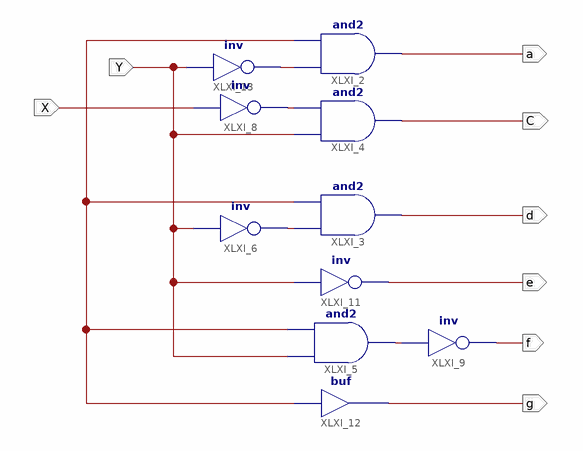
[diagram p0: schematic sheet 1]
// Xilinx ISE schematic SW.sch (spartan6) as structural Verilog: 10 symbols, 8 ports
module SW (
  input  X,
  input  Y,
  output C,
  output d,
  output e,
  output f,
  output a,
  output g
);

  wire XLXN_2, XLXN_16, XLXN_17, XLXN_18, XLXN_44;

  and XLXI_2 (a, XLXN_44, XLXN_2);
  and XLXI_3 (d, XLXN_18, XLXN_2);
  and XLXI_4 (C, Y, XLXN_17);
  and XLXI_5 (XLXN_16, Y, XLXN_2);
  not XLXI_6 (XLXN_18, Y);
  not XLXI_8 (XLXN_17, X);
  not XLXI_9 (f, XLXN_16);
  not XLXI_11 (e, Y);
  buf XLXI_12 (g, XLXN_2);
  not XLXI_13 (XLXN_44, Y);
endmodule
